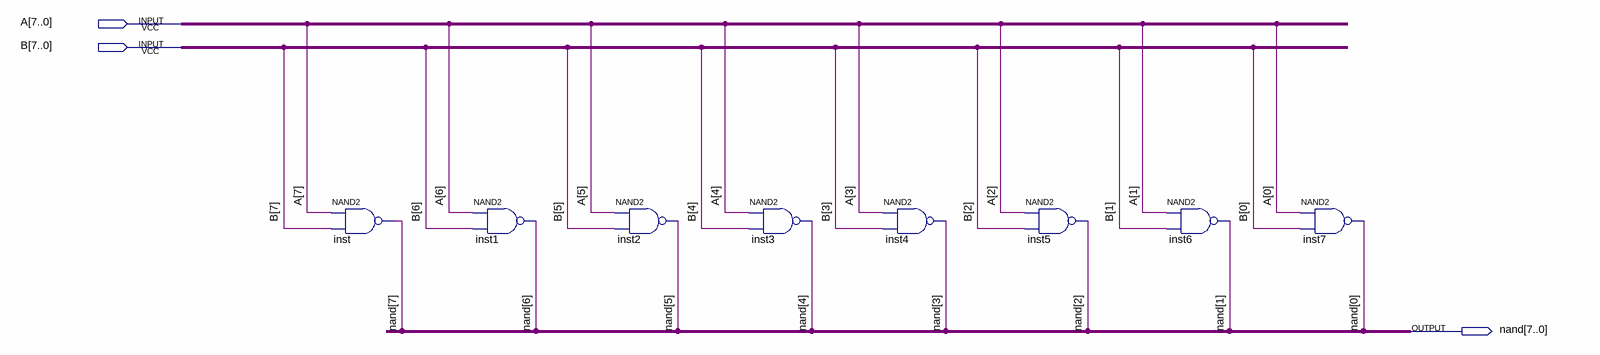
[diagram p0: schematic sheet]
// Quartus schematic nand_logic8bit.bdf as structural Verilog: 8 symbols, 3 pins
module nand_logic8bit (
  input  [7:0] A,
  input  [7:0] B,
  output [7:0] \nand 
);

  nand inst (\nand [7], A[7], B[7]);
  nand inst1 (\nand [6], A[6], B[6]);
  nand inst2 (\nand [5], A[5], B[5]);
  nand inst3 (\nand [4], A[4], B[4]);
  nand inst4 (\nand [3], A[3], B[3]);
  nand inst5 (\nand [2], A[2], B[2]);
  nand inst6 (\nand [1], A[1], B[1]);
  nand inst7 (\nand [0], A[0], B[0]);
endmodule
